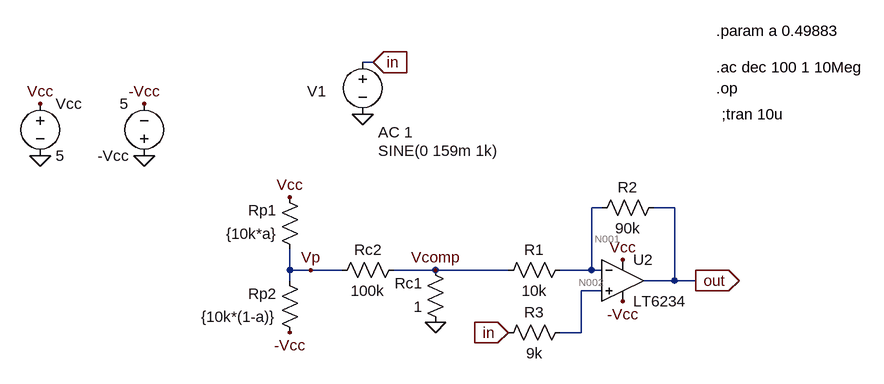
[diagram p0: schematic AC.asc]
* AC.asc
Vcc Vcc 0 5
V§-Vcc 0 -Vcc 5
* U2: LT6234 (symbol OpAmps\LT6234 not available, pins judged from their places): In+=N002 In-=N001 V+=Vcc V-=-Vcc OUT=out
R1 N001 Vcomp 10k
R2 out N001 90k
R3 N002 in 9k
Rc1 0 Vcomp 1
Rc2 Vcomp Vp 100k
Rp1 Vp Vcc {10k*a}
Rp2 -Vcc Vp {10k*(1-a)}
V1 in 0 SINE(0 159m 1k) AC 1
.ac dec 100 1 10Meg
.op
;tran 10u
.param a 0.49883
.backanno
.end

* Results of the author's LTspice run, read from the files saved beside the schematic
* Operating Point, zero values left out:
*   V(vcc) = 5 V
*   V(-vcc) = -5 V
*   V(out) = -5.337 nV
*   V(n002) = -13.49 mV
*   V(n001) = -13.5 mV
*   V(vcomp) = -1.235 µV
*   V(vp) = 11.41 mV
*   I(R1) = -1.349 µA
*   I(R2) = 149.9 nA
*   I(R3) = -1.499 µA
*   I(Rc1) = 1.235 µA
*   I(Rc2) = -114.2 nA
*   I(Rp1) = -1 mA
*   I(Rp2) = -999.9 µA
*   I(Vcc) = -2.04 mA
*   I(-vcc) = -2.043 mA
*   I(V1) = -1.499 µA
*   Ix(u2:1) = 1.499 µA
*   Ix(u2:2) = 1.499 µA
*   Ix(u2:3) = -149.9 nA
*   Ix(u2:4) = 1.04 mA
*   Ix(u2:5) = -1.043 mA
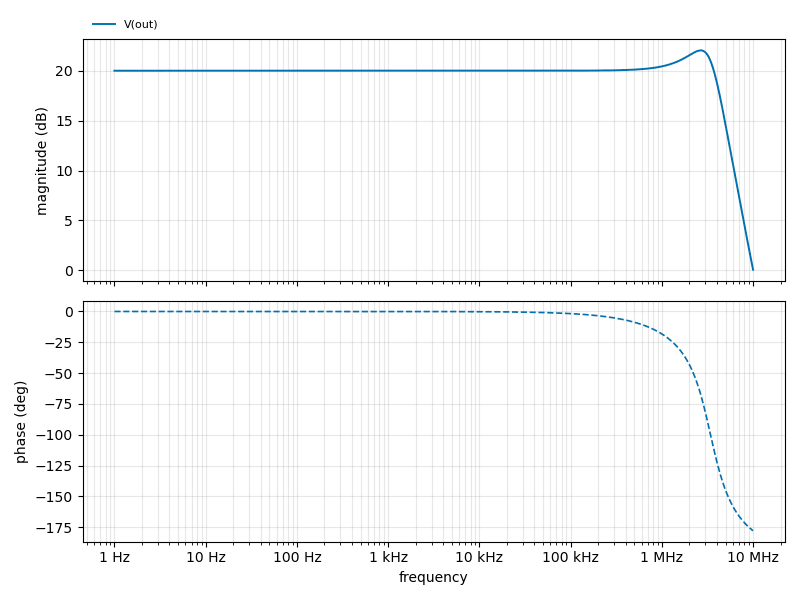
[diagram p1: AC Analysis of AC.asc, plotted from the saved traces]
* AC Analysis, 1 run:
*   V(out): 20.00 dB at 1 Hz, 0.06 dB at 10 MHz, peak 22.03 dB at 2.692 MHz, 3 dB below the peak at 3.96 MHz
* From the log:
*   Semiconductor Device Operating Points:
*                           --- Diodes ---
*   Name:    d:u2:5      d:u2:8      d:u2:1      d:u2:2      d:u2:4
*   Model:  u2:dlimn1   u2:dlimp1    u2:din     u2:dlimp2   u2:dlimn2
*   Id:      3.72e-09    3.72e-09   -6.40e-13    4.34e-10    4.34e-10
*   Vd:      3.72e-01    3.72e-01   -6.40e-07    3.72e-01    3.72e-01
*   Req:     1.00e-08    1.00e-08    1.00e-06    3.33e-08    3.33e-08
*   CAP:     0.00e+00    0.00e+00    0.00e+00    0.00e+00    0.00e+00
*   Name:    d:u2:7      d:u2:3      d:u2:6
*   Model:  u2:dlim2    u2:dbias    u2:dbias
*   Id:      2.97e-09    1.50e-06    1.50e-06
*   Vd:      2.08e-01    4.99e+00    4.99e+00
*   Req:     1.43e-08    2.00e-04    2.00e-04
*   CAP:     0.00e+00    0.00e+00    0.00e+00
*                           --- VDMOSFET Transistors ---
*   Name:        m:u2:1      m:u2:2
*   Model:        u2:ni       u2:pi
*   Id:          1.04e-03   -1.04e-03
*   Vgs:         3.72e-01   -3.72e-01
*   Vds:         5.00e+00   -5.00e+00
*   Vth:         3.00e-01   -3.00e-01
*   Gm:          2.88e-02    2.88e-02
*   Gds:         0.00e+00    0.00e+00
*   Cgs:         0.00e+00    0.00e+00
*   Cgd:         0.00e+00    0.00e+00
*   Cbody:       0.00e+00    0.00e+00